# Altium schematic sheet Input_analog.SchDoc
size A4
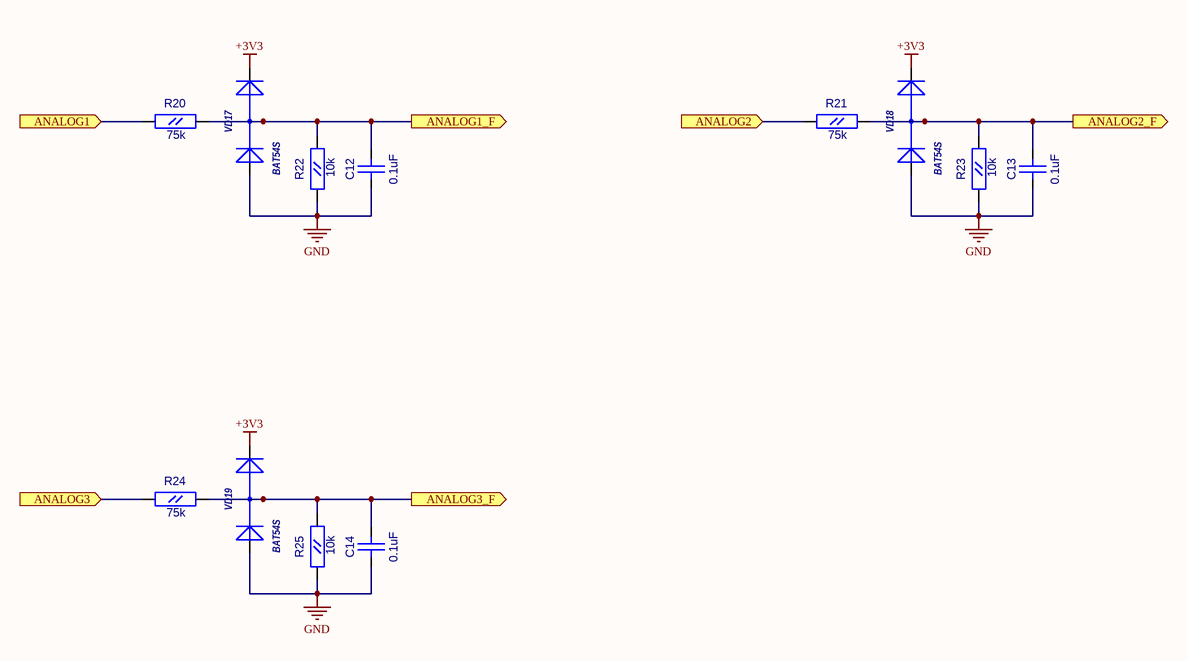
[diagram p0: Input_analog.SchDoc]

## Parts
C12  0.1uF  [CC0603]
C13  0.1uF  [CC0603]
C14  0.1uF  [CC0603]
R20  75k  [RC0603]
R21  75k  [RC0603]
R22  10k  [RC0603]
R23  10k  [RC0603]
R24  75k  [RC0603]
R25  10k  [RC0603]
VD17  BAT54S  [SOT-23(GSD)]
VD18  BAT54S  [SOT-23(GSD)]
VD19  BAT54S  [SOT-23(GSD)]

## Ports
ANALOG1 (in), ANALOG1_F (out), ANALOG2 (in), ANALOG2_F (out), ANALOG3 (in), ANALOG3_F (out)

## Nets
+3V3: VD17.2(K) VD18.2(K) VD19.2(K)
GND: C12.1(A) C13.1(A) C14.1(A) R22.1(A) R23.1(A) R25.1(A) VD17.1(A) VD18.1(A) VD19.1(A)
ANALOG1: R20.1(A) ; port ANALOG1
ANALOG1_F: C12.2(B) R20.2(B) R22.2(B) VD17.3(AK) ; port ANALOG1_F
ANALOG2: R21.1(A) ; port ANALOG2
ANALOG2_F: C13.2(B) R21.2(B) R23.2(B) VD18.3(AK) ; port ANALOG2_F
ANALOG3: R24.1(A) ; port ANALOG3
ANALOG3_F: C14.2(B) R24.2(B) R25.2(B) VD19.3(AK) ; port ANALOG3_F

## Library data of the parts
C12-C14 = CC0603: Value: 0.1uF
R20-R25 = RC0603
  R20 R21 R24: Value: 75k
  R22 R23 R25: Value: 10k
VD17-VD19 = BAT54S: 1.0 Ampere General Purpose Rectifier; ComponentField6: Published 8-Jun-2000, Modified 11-July-2000: SIM Model Added.; Value: *